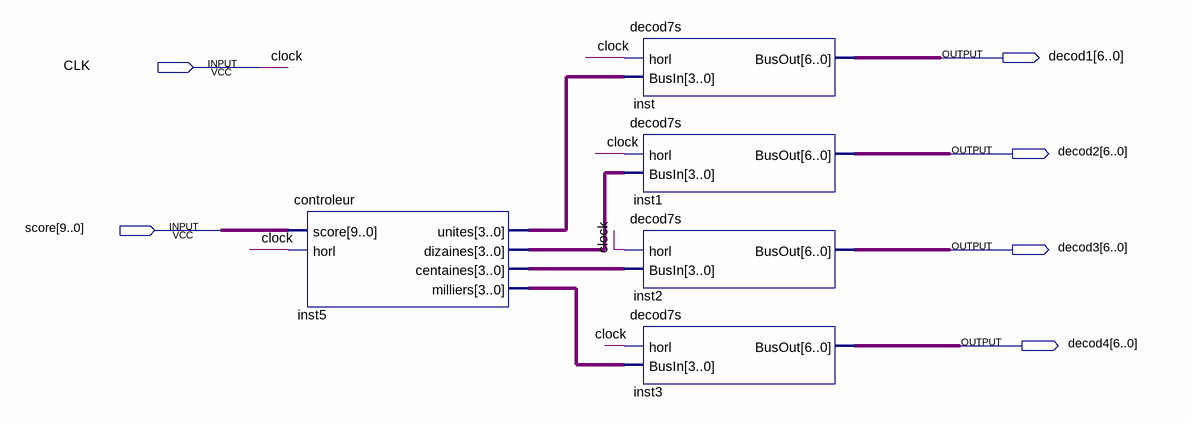
[diagram p0: schematic sheet]
// Quartus schematic afficheur_score.bdf as structural Verilog: 5 symbols, 6 pins
module afficheur_score (
  input  CLK,
  input  [9:0] score,
  output [6:0] decod1,
  output [6:0] decod2,
  output [6:0] decod3,
  output [6:0] decod4
);

  wire [3:0] inst5_centaines, inst5_dizaines, inst5_milliers, inst5_unites;

  controleur inst5 (
    .score(score), .horl(CLK), .unites(inst5_unites), .dizaines(inst5_dizaines), .centaines(inst5_centaines),
    .milliers(inst5_milliers));
  decod7s inst (.horl(CLK), .BusIn(inst5_unites), .BusOut(decod1));
  decod7s inst1 (.horl(CLK), .BusIn(inst5_dizaines), .BusOut(decod2));
  decod7s inst2 (.horl(CLK), .BusIn(inst5_centaines), .BusOut(decod3));
  decod7s inst3 (.horl(CLK), .BusIn(inst5_milliers), .BusOut(decod4));

  // Other names for the same wires on the sheet: clock = CLK
endmodule
